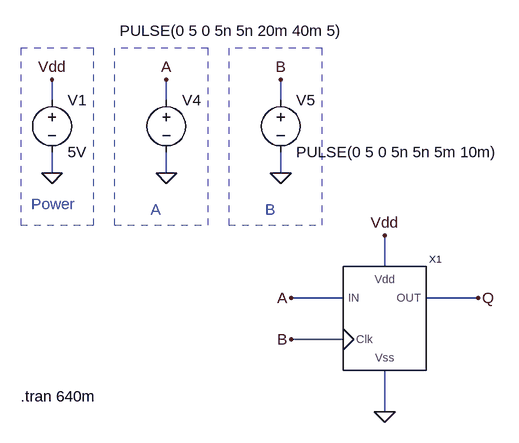
[diagram p0: schematic shift_register_block.asc]
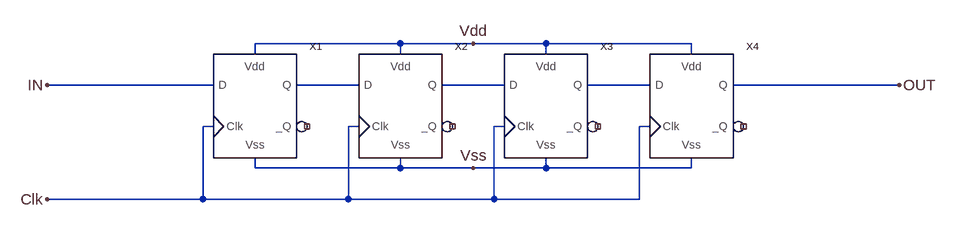
[diagram p1: sub-circuit shift_register.asc]
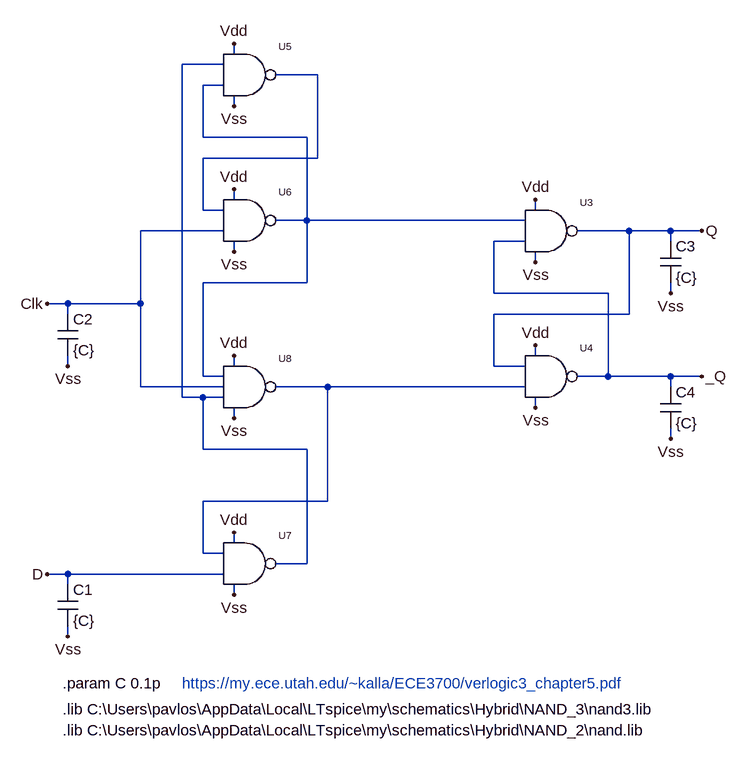
[diagram p2: sub-circuit dff_p.asc]
shift_register_block.asc, the LTspice schematic file:
Version 4
SHEET 1 896 680
WIRE -560 -416 -560 -448
WIRE -384 -416 -384 -448
WIRE -208 -416 -208 -448
WIRE -560 -304 -560 -336
WIRE -384 -304 -384 -336
WIRE -208 -304 -208 -336
WIRE -48 -160 -48 -208
WIRE -112 -112 -192 -112
WIRE 96 -112 16 -112
WIRE -112 -48 -192 -48
WIRE -48 64 -48 0
FLAG 96 -112 Q
FLAG -192 -112 A
FLAG -48 -208 Vdd
FLAG -48 64 0
FLAG -560 -304 0
FLAG -560 -448 Vdd
FLAG -192 -48 B
FLAG -384 -304 0
FLAG -384 -448 A
FLAG -208 -304 0
FLAG -208 -448 B
SYMBOL voltage -560 -432 R0
WINDOW 123 0 0 Left 0
WINDOW 39 0 0 Left 0
SYMATTR InstName V1
SYMATTR Value 5V
SYMBOL voltage -384 -432 R0
WINDOW 123 0 0 Left 0
WINDOW 39 0 0 Left 0
WINDOW 3 -72 -91 Left 2
SYMATTR Value PULSE(0 5 0 5n 5n 20m 40m 5)
SYMATTR InstName V4
SYMBOL voltage -208 -432 R0
WINDOW 123 0 0 Left 0
WINDOW 39 0 0 Left 0
SYMATTR InstName V5
SYMATTR Value PULSE(0 5 0 5n 5n 5m 10m)
SYMBOL shift_register -112 0 R0
SYMATTR InstName X1
TEXT -592 -256 Left 2 ;Power
TEXT -608 40 Left 2 !.tran 640m
TEXT -408 -248 Left 2 ;A
TEXT -232 -248 Left 2 ;B
RECTANGLE Normal -496 -496 -608 -224 2
RECTANGLE Normal -320 -496 -464 -224 2
RECTANGLE Normal -144 -496 -288 -224 2

shift_register.asc, the sub-circuit schematic file:
Version 4
SHEET 1 880 680
WIRE -208 -384 -432 -384
WIRE -96 -384 -208 -384
WIRE 16 -384 -96 -384
WIRE 240 -384 16 -384
WIRE -432 -368 -432 -384
WIRE -208 -368 -208 -384
WIRE 16 -368 16 -384
WIRE 240 -368 240 -384
WIRE -496 -320 -752 -320
WIRE -272 -320 -368 -320
WIRE -48 -320 -144 -320
WIRE 176 -320 80 -320
WIRE 560 -320 304 -320
WIRE -496 -256 -512 -256
WIRE -272 -256 -288 -256
WIRE -48 -256 -64 -256
WIRE 176 -256 160 -256
WIRE -432 -192 -432 -208
WIRE -208 -192 -208 -208
WIRE -208 -192 -432 -192
WIRE -96 -192 -208 -192
WIRE 16 -192 16 -208
WIRE 16 -192 -96 -192
WIRE 240 -192 240 -208
WIRE 240 -192 16 -192
WIRE -512 -144 -512 -256
WIRE -512 -144 -752 -144
WIRE -288 -144 -288 -256
WIRE -288 -144 -512 -144
WIRE -64 -144 -64 -256
WIRE -64 -144 -288 -144
WIRE 160 -144 160 -256
WIRE 160 -144 -64 -144
FLAG -752 -144 Clk
FLAG -752 -320 IN
FLAG 560 -320 OUT
FLAG -96 -384 Vdd
FLAG -96 -192 Vss
SYMBOL dff_p -496 -208 R0
SYMATTR InstName X1
SYMBOL dff_p -272 -208 R0
SYMATTR InstName X2
SYMBOL dff_p -48 -208 R0
SYMATTR InstName X3
SYMBOL dff_p 176 -208 R0
SYMATTR InstName X4

dff_p.asc, the sub-circuit schematic file:
Version 4
SHEET 1 880 680
WIRE -464 -720 -464 -736
WIRE -480 -704 -544 -704
WIRE -336 -688 -400 -688
WIRE -480 -672 -512 -672
WIRE -464 -640 -464 -656
WIRE -512 -592 -512 -672
WIRE -352 -592 -512 -592
WIRE -336 -560 -336 -688
WIRE -336 -560 -512 -560
WIRE -464 -496 -464 -512
WIRE -512 -480 -512 -560
WIRE -480 -480 -512 -480
WIRE 0 -480 0 -496
WIRE -352 -464 -352 -592
WIRE -352 -464 -400 -464
WIRE -16 -464 -352 -464
WIRE -480 -448 -608 -448
WIRE 144 -448 64 -448
WIRE 208 -448 144 -448
WIRE 256 -448 208 -448
WIRE -16 -432 -64 -432
WIRE 208 -432 208 -448
WIRE -464 -416 -464 -432
WIRE 0 -400 0 -416
WIRE -352 -368 -352 -464
WIRE -352 -368 -512 -368
WIRE -64 -352 -64 -432
WIRE 112 -352 -64 -352
WIRE 208 -352 208 -368
WIRE -720 -336 -752 -336
WIRE -608 -336 -608 -448
WIRE -608 -336 -720 -336
WIRE -720 -320 -720 -336
WIRE 144 -320 144 -448
WIRE 144 -320 -64 -320
WIRE 0 -256 0 -272
WIRE -720 -240 -720 -256
WIRE -464 -240 -464 -256
WIRE -64 -240 -64 -320
WIRE -16 -240 -64 -240
WIRE -512 -224 -512 -368
WIRE -480 -224 -512 -224
WIRE 112 -224 112 -352
WIRE 112 -224 64 -224
WIRE 208 -224 112 -224
WIRE 256 -224 208 -224
WIRE -608 -208 -608 -336
WIRE -480 -208 -608 -208
WIRE -320 -208 -400 -208
WIRE -16 -208 -320 -208
WIRE 208 -208 208 -224
WIRE -544 -192 -544 -704
WIRE -512 -192 -544 -192
WIRE -480 -192 -512 -192
WIRE 0 -176 0 -192
WIRE -464 -160 -464 -176
WIRE 208 -128 208 -144
WIRE -512 -112 -512 -192
WIRE -352 -112 -512 -112
WIRE -320 -32 -320 -208
WIRE -320 -32 -512 -32
WIRE -464 32 -464 16
WIRE -512 48 -512 -32
WIRE -480 48 -512 48
WIRE -352 64 -352 -112
WIRE -352 64 -400 64
WIRE -720 80 -752 80
WIRE -480 80 -720 80
WIRE -720 96 -720 80
WIRE -464 112 -464 96
WIRE -720 176 -720 160
FLAG -464 16 Vdd
FLAG 0 -496 Vdd
FLAG -464 -256 Vdd
FLAG -464 -160 Vss
FLAG -464 112 Vss
FLAG 0 -400 Vss
FLAG -752 -336 Clk
FLAG -752 80 D
FLAG 256 -448 Q
FLAG 256 -224 _Q
FLAG -464 -736 Vdd
FLAG -464 -416 Vss
FLAG 0 -272 Vdd
FLAG -464 -640 Vss
FLAG -464 -512 Vdd
FLAG 0 -176 Vss
FLAG -720 -240 Vss
FLAG -720 176 Vss
FLAG 208 -128 Vss
FLAG 208 -352 Vss
SYMBOL nand -16 -416 R0
SYMATTR InstName U3
SYMBOL nand -16 -192 R0
SYMATTR InstName U4
SYMBOL nand -480 -656 R0
SYMATTR InstName U5
SYMBOL nand -480 -432 R0
SYMATTR InstName U6
SYMBOL nand -480 96 R0
SYMATTR InstName U7
SYMBOL nand3 -480 -176 R0
SYMATTR InstName U8
SYMBOL cap -736 96 R0
SYMATTR InstName C1
SYMATTR Value {C}
SYMBOL cap -736 -320 R0
SYMATTR InstName C2
SYMATTR Value {C}
SYMBOL cap 192 -432 R0
SYMATTR InstName C3
SYMATTR Value {C}
SYMBOL cap 192 -208 R0
SYMATTR InstName C4
SYMATTR Value {C}
TEXT -728 288 Left 2 !.lib C:\\Users\\pavlos\\AppData\\Local\\LTspice\\my\\schematics\\Hybrid\\NAND_3\\nand3.lib
TEXT -728 320 Left 2 !.lib C:\\Users\\pavlos\\AppData\\Local\\LTspice\\my\\schematics\\Hybrid\\NAND_2\\nand.lib
TEXT -728 248 Left 2 !.param C 0.1p
TEXT -544 248 Left 2 ;https://my.ece.utah.edu/~kalla/ECE3700/verlogic3_chapter5.pdf

The netlist it stands for:
* shift_register_block.asc
V1 Vdd 0 5V
V4 A 0 PULSE(0 5 0 5n 5n 20m 40m 5)
V5 B 0 PULSE(0 5 0 5n 5n 5m 10m)
XX1 A B Q Vdd 0 shift_register

* block symbol definitions
.subckt shift_register IN Clk OUT Vdd Vss
XX1 IN Clk N001 NC_01 Vdd Vss dff_p
XX2 N001 Clk N002 NC_02 Vdd Vss dff_p
XX3 N002 Clk N003 NC_03 Vdd Vss dff_p
XX4 N003 Clk OUT NC_04 Vdd Vss dff_p
.ends shift_register

.subckt dff_p D Clk Q _Q Vdd Vss
XU3 N003 _Q Q Vdd Vss nand  ; pins A B Y Vdd Vss
XU4 Q N004 _Q Vdd Vss nand  ; pins A B Y Vdd Vss
XU5 N001 N003 N002 Vdd Vss nand  ; pins A B Y Vdd Vss
XU6 N002 Clk N003 Vdd Vss nand  ; pins A B Y Vdd Vss
XU7 N004 D N001 Vdd Vss nand  ; pins A B Y Vdd Vss
XU8 N003 Clk N001 N004 Vdd Vss nand3  ; pins A B C Y Vdd Vss
C1 D Vss {C}
C2 Clk Vss {C}
C3 Q Vss {C}
C4 _Q Vss {C}
.lib C:\Users\pavlos\AppData\Local\LTspice\my\schematics\Hybrid\NAND_3\nand3.lib
.lib C:\Users\pavlos\AppData\Local\LTspice\my\schematics\Hybrid\NAND_2\nand.lib
.param C 0.1p
* https://my.ece.utah.edu/~kalla/ECE3700/verlogic3_chapter5.pdf
.ends dff_p

* Power
.tran 640m
* A
* B
.backanno
.end